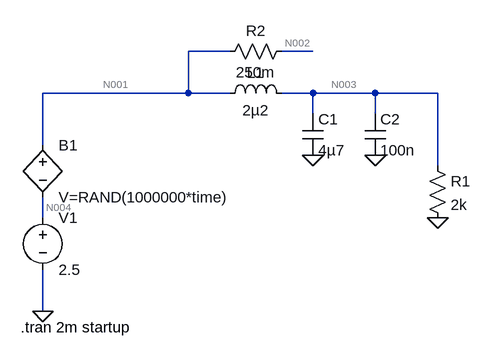
[diagram p0: schematic vccfilter.asc]
vccfilter.asc, the LTspice schematic file:
Version 4
SHEET 1 1220 680
WIRE 320 -160 256 -160
WIRE 448 -160 400 -160
WIRE 256 -96 256 -160
WIRE 256 -96 32 -96
WIRE 320 -96 256 -96
WIRE 448 -96 400 -96
WIRE 544 -96 448 -96
WIRE 640 -96 544 -96
WIRE 448 -64 448 -96
WIRE 544 -64 544 -96
WIRE 32 -16 32 -96
WIRE 640 16 640 -96
WIRE 32 96 32 64
WIRE 32 240 32 176
FLAG 32 240 0
FLAG 640 96 0
FLAG 448 0 0
FLAG 544 0 0
SYMBOL voltage 32 80 R0
WINDOW 39 0 0 Left 2
SYMATTR InstName V1
SYMATTR Value 2.5
SYMATTR Value2 AC 0
SYMBOL res 624 0 R0
SYMATTR InstName R1
SYMATTR Value 2k
SYMBOL bv 32 -32 R0
SYMATTR InstName B1
SYMATTR Value V=RAND(1000000*time)
SYMBOL ind 304 -80 R270
WINDOW 0 32 56 VTop 2
WINDOW 3 5 56 VBottom 2
SYMATTR InstName L1
SYMATTR Value 2µ2
SYMATTR SpiceLine Rser=250m
SYMBOL cap 432 -64 R0
SYMATTR InstName C1
SYMATTR Value 4µ7
SYMBOL cap 528 -64 R0
SYMATTR InstName C2
SYMATTR Value 100n
SYMBOL res 304 -144 R270
WINDOW 0 32 56 VTop 2
WINDOW 3 0 56 VBottom 2
SYMATTR InstName R2
SYMATTR Value 250m
TEXT -2 264 Left 2 !.tran 2m startup

The netlist it stands for:
* vccfilter.asc
V1 N004 0 2.5 AC 0
R1 N003 0 2k
B1 N001 N004 V=RAND(1000000*time)
L1 N001 N003 2µ2 Rser=250m
C1 N003 0 4µ7
C2 N003 0 100n
R2 N001 N002 250m
.tran 2m startup
.backanno
.end

* Results of the author's LTspice run, read from the files saved beside the schematic
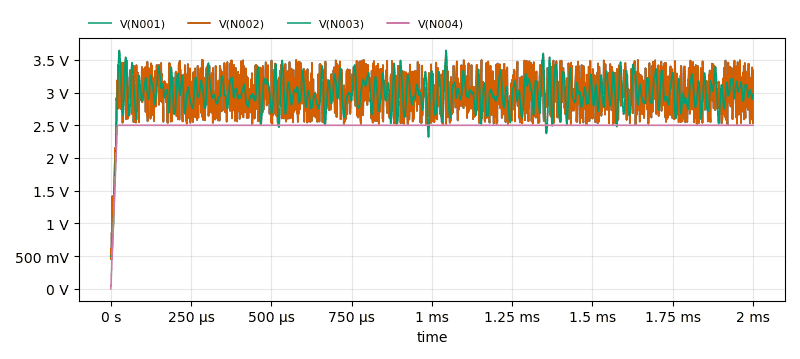
[diagram p1: Transient Analysis of vccfilter.asc, plotted from the saved traces]
* Transient Analysis, 1 run:
*   V(N001): min 451.4 mV, max 3.499 V, average 2.981 V, rms 2.997 V, last 2.532 V
*   V(N002): min 451.4 mV, max 3.499 V, average 2.981 V, rms 2.997 V, last 2.532 V
*   V(N003): min 499.9 mV, max 3.645 V, average 2.979 V, rms 2.992 V, last 2.972 V
*   V(N004): min 0 V, max 2.5 V, average 2.487 V, rms 2.492 V, last 2.5 V